# EAGLE design MOSFET_motor_driver (EAGLE 7.7.0)
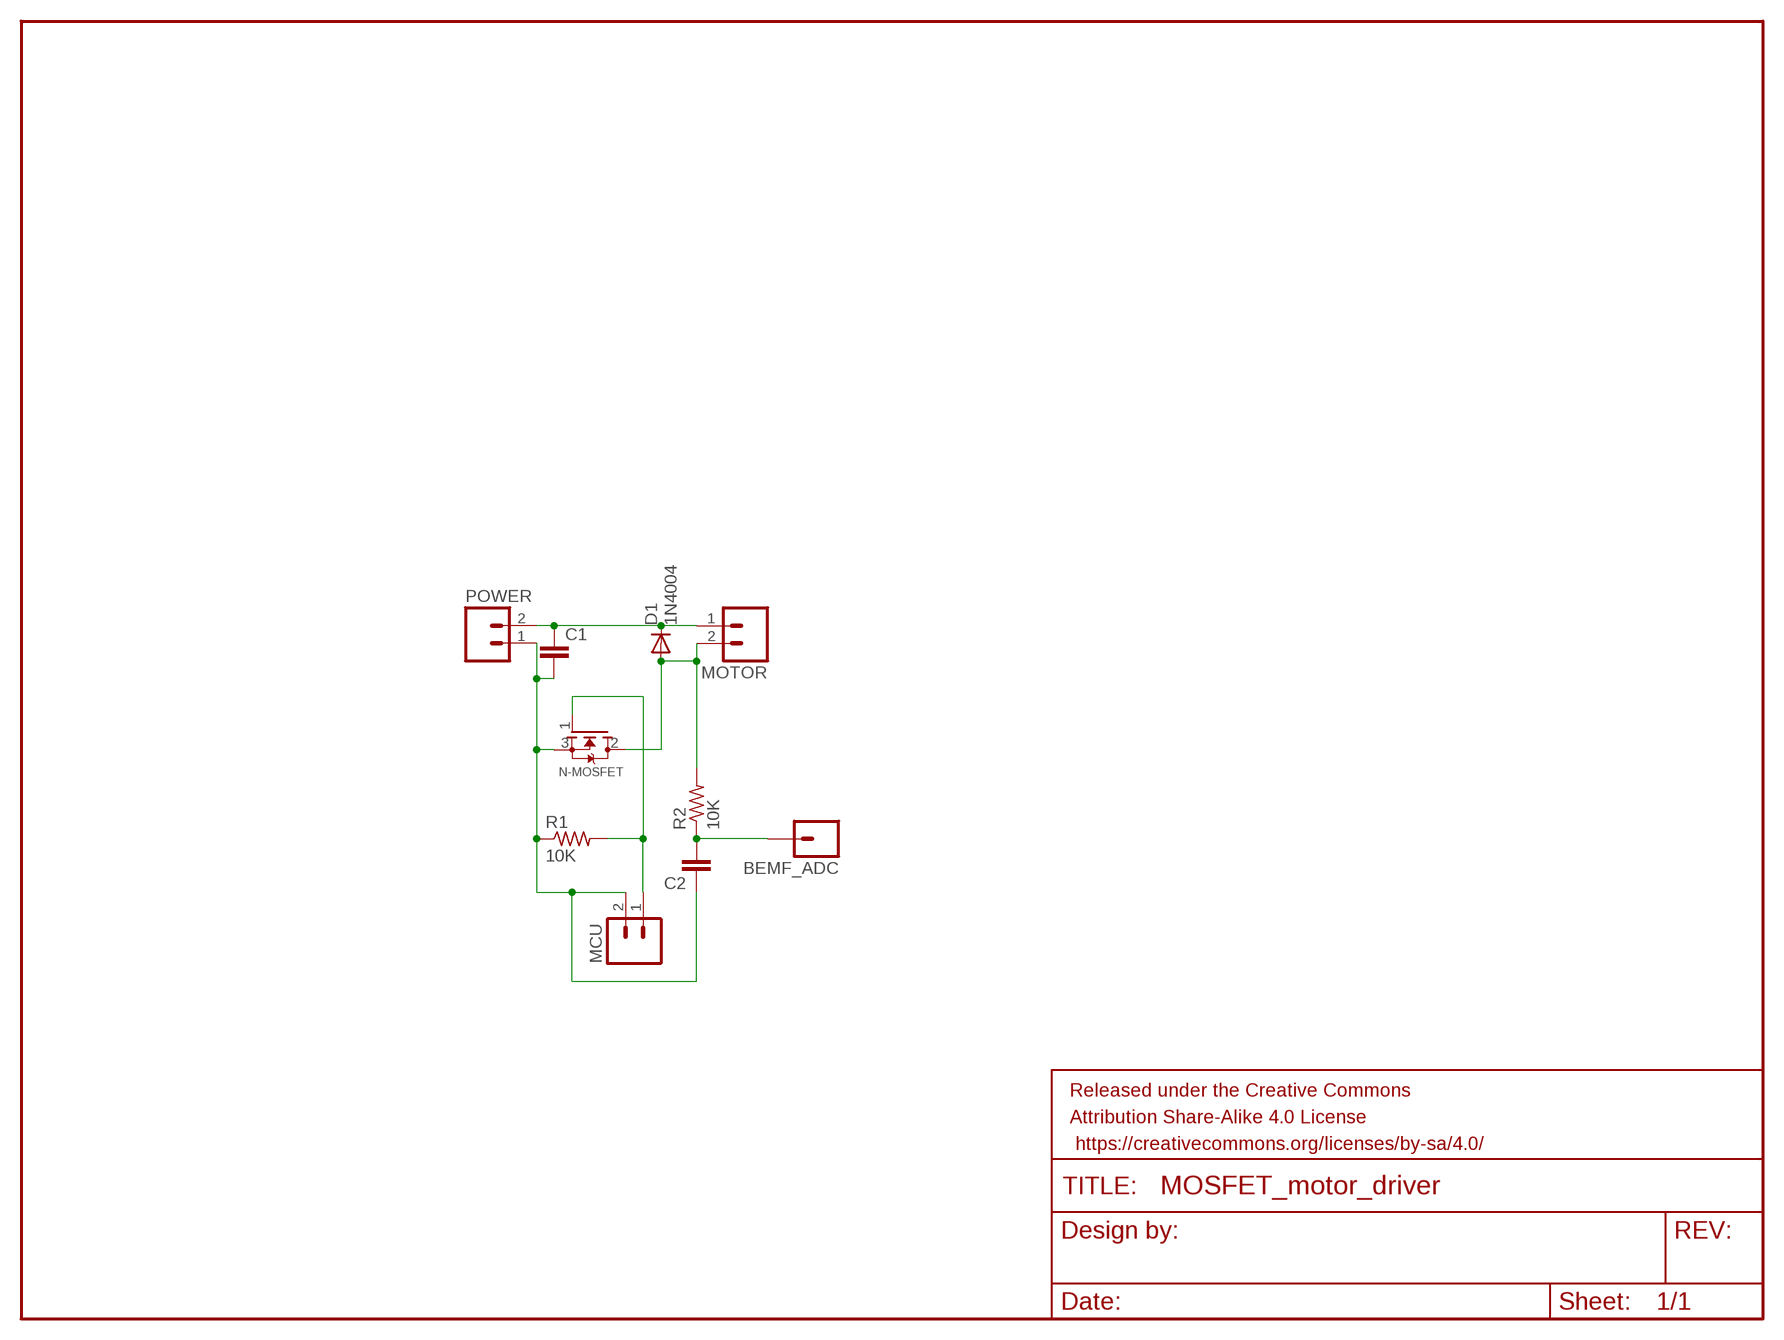
[diagram p0: schematic, sheet 1]

## Parts
BEMF_ADC  M01PTH  [1X01]
C1  CAPPTH  [CAP-PTH-SMALL]
C2  CAPPTH  [CAP-PTH-SMALL]
D1  1N4004  [DO41-10]
FRAME1  FRAME-LETTER  [CREATIVE_COMMONS]
MCU  M02PTH  [1X02]
MOTOR  M02PTH  [1X02]
N-MOSFET  MOSFET-NGDS_TO220V  [TO220V]
POWER  M02PTH  [1X02]
R1  10K  R-US_0207/10  [0207/10]
R2  10K  R-US_0207/10  [0207/10]

## Nets
GND: C1.2 C2.1 MCU.2 N-MOSFET.3(S) POWER.1 R1.1
N$1: BEMF_ADC.1 C2.2 R2.1
N$2: MCU.1 N-MOSFET.1(G) R1.2
N$3: D1.A MOTOR.2 N-MOSFET.2(D) R2.2
N$4: C1.1 D1.C MOTOR.1 POWER.2

## Library data of the parts
BEMF_ADC = SparkFun-Connectors:M01: Header 1 Standard 1-pin 0.1" header. Use with straight break away headers (SKU : PRT-00116), right angle break away headers (PRT-00553), swiss pins (PRT-00743), machine pins (PRT-00117), and female headers (PRT-00115).
C1 C2 = SparkFun-Passives:CAP: Capacitor Standard 0603 ceramic capacitor, and 0.1" leaded capacitor.
D1 = diode:1N4004: DIODE general purpose rectifier, 1 A
FRAME1 = SparkFun-Aesthetics:FRAME-LETTER: Schematic Frame Standard 8.5x11 US Letter frame
MCU MOTOR POWER = SparkFun-Connectors:M02: Standard 2-pin 0.1" header. Use with - straight break away headers ( PRT-00116) - right angle break away headers (PRT-00553) - swiss pins (PRT-00743) - machine pins (PRT-00117) - female headers (PRT-00115) Molex polarized connector foot print use with: PRT-08233 with associated crimp pins and housings. 2.54_SCREWTERM for use with PRT-10571. 3.5mm Screw Terminal footprints for PRT-08084 5mm Screw Terminal footprints for use with PRT-08432
N-MOSFET = adafruit:MOSFET-N: N-Channel Mosfet 2N7002E - 60V 260mA SOT23 [Digikey: 2N7002ET1GOSTR-ND] - REEL BSH103 - 30V 850mA SOT23 [Digikey: 568-5013-1-ND]
R1 R2 = adafruit:R-US_: RESISTOR, American symbol

## Board
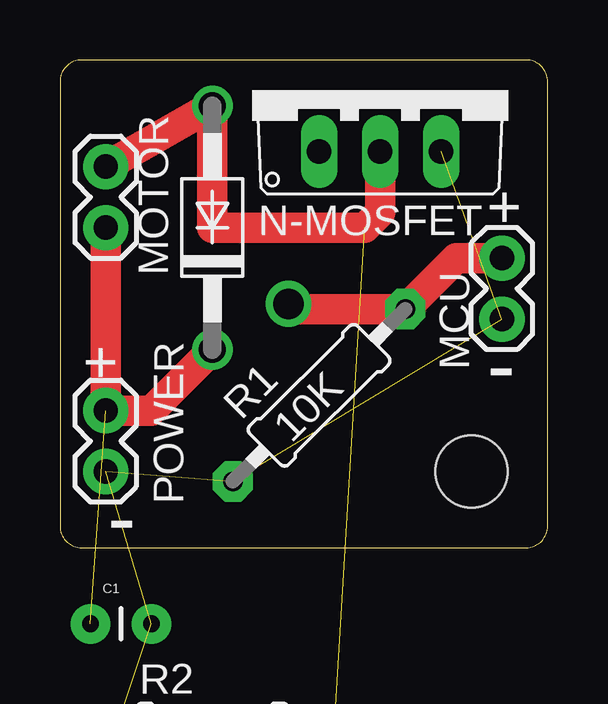
[diagram p1: board, top side]
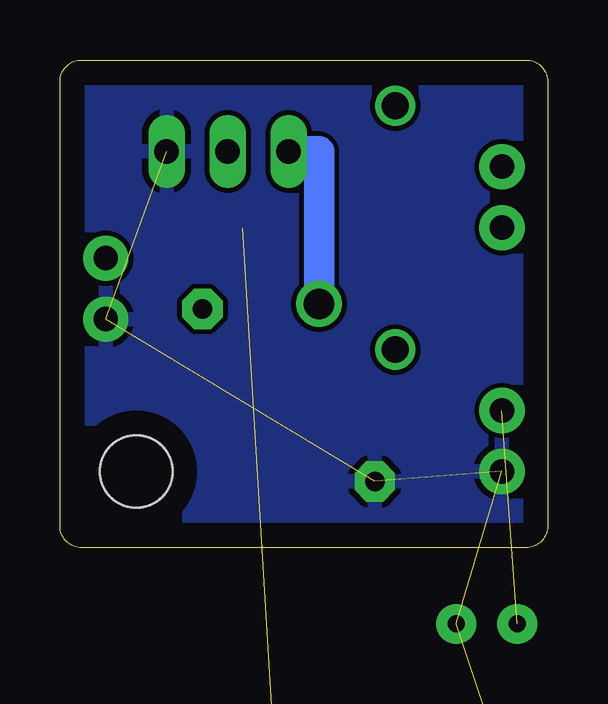
[diagram p2: board, bottom side, seen from below]

Size 20.32 x 20.32 mm. Coordinates in mm from the lower left corner, seen from the top.
Outline: 0,19.42 0,0.9 arc90 0.9,0 19.42,0 arc90 20.32,0.9 20.32,19.42 arc90 19.42,20.32 0.9,20.32 arc90 0,19.42
Copper layers (1*16): Top 0.035mm / dielectric 1.5mm / Bottom 0.035mm
Design rules "default": minimum track width 10mil, minimum drill 24mil, track to track 8mil, track to pad 8mil, pad to pad 8mil, via to via 8mil, smd to smd 8mil, copper to edge 40mil, drill to drill 8mil, minimum pad ring 10mil, minimum via ring 8mil, stop-mask expansion 4mil, vias tented up to drill 0mil, thermal gap 10mil
Holes 3.02 mm at 17.14,3.17

### Footprints (pad centres in the part's own frame; a part is rotated, then mirrored left to right if it is on the bottom)
1X01 = drill 1.016 pad 1.88: 1 0,0
CAP-PTH-SMALL = drill 0.7 pad 1.651: 1 0,0; 2 2.54,0
DO41-10 = drill 1.118: A 5.08,0; C -5.08,0
1X02 = drill 1.016 pad 1.88: 1 0,0; 2 2.54,0
TO220V = drill 1.016 long: 1 -2.54,-2.54; 2 0,-2.54; 3 2.54,-2.54
0207/10 = drill 0.813 pad 1.676 octagon: 1 -5.08,0; 2 5.08,0

### Placement (x,y rotation side)
BEMF_ADC  1.91,-15.88 0 top  (outside the outline)
C1  1.27,-3.17 0 top  (outside the outline)
C2  1.27,-10.79 0 top  (outside the outline)
D1  6.35,13.34 90 top
MCU  18.41,12.06 270 top
MOTOR  1.91,13.34 90 top
N-MOSFET  13.34,19.05 0 top
POWER  1.91,3.17 90 top
R1  10.79,6.35 45 top
R2  6.35,-7.62 0 top  (outside the outline)

### Tracks (layer width: path | path; a pad name or v marks a point on that pad's centre or on a via)
GND  (5 unrouted)
  pour Bottom: 0,20.32 20.32,20.32 20.32,0 0,0
N$1  (2 unrouted)
N$2  (via drill 1.27)
  Top 0.61: R1.2 14.61,9.94
  Top 1.27: 14.61,9.94 14.61,10.16 16.51,12.06 MCU.1 | R1.2 9.74,9.94 v9.53,10.16
  Bottom 1.27: v9.53,10.16 9.53,16.51 N-MOSFET.1
N$3  (1 unrouted)
  Top 1.27: MOTOR.2 D1.A 6.35,13.34 12.7,13.34 13.34,13.97 N-MOSFET.2
N$4  (1 unrouted)
  Top 1.27: MOTOR.1 POWER.2 3.81,5.71 D1.C

### Text on the board
tPlace: + | + | - | -